# Altium schematic sheet USB_Type-C.SchDoc
size A4; SheetNumber: 10; SheetTotal: 12
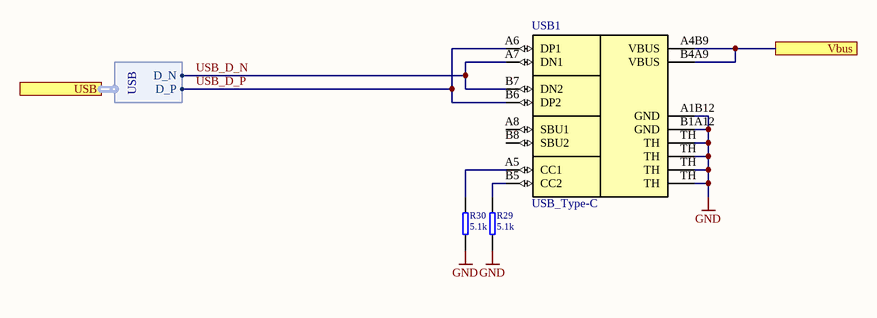
[diagram p0: USB_Type-C.SchDoc]

## Parts
R29  value 5.1k  [RES 0402]
R30  value 5.1k  [RES 0402]
USB1  USB_Type-C  [USB_Type-C]

## Ports
USB (harness USB), Vbus

## Harnesses
USB: D_N, D_P

## Nets
GND: R29.1 R30.1 USB1.A1B12(GND) USB1.B1A12(GND) USB1.TH
USB_D_N: USB1.A7(DN1) USB1.B7(DN2) ; port USB.D_N
USB_D_P: USB1.A6(DP1) USB1.B6(DP2) ; port USB.D_P
Vbus: USB1.A4B9(VBUS) USB1.B4A9(VBUS) ; port Vbus
NetR29_2: R29.2 USB1.B5(CC2)
NetR30_2: R30.2 USB1.A5(CC1)

Not connected (* = marked no-connect by the designer): USB1 A8(SBU1) B8(SBU2)

## Library data of the parts
R29 R30 = !Resistor: Resistor; IsSMT: NoSMT
USB1 = USB_Type-C: USB Type-C connector